# Altium schematic sheet FETs.SchDoc: FET System
size A4; ApprovedBy: Self; CheckedBy: Self; CompanyName: TAISAT; DrawnBy: Alperen FENERCİ; Organization: IKA; SheetNumber: 3; SheetTotal: 6
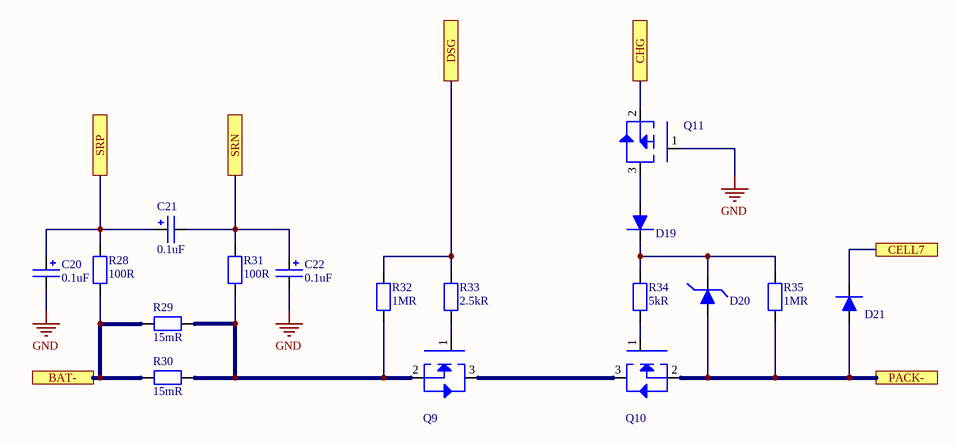
[diagram p0: FETs.SchDoc]

## Parts
C20  value 0.1uF  [CAP 0603]  (hidden comment: CAP 0603)
C21  value 0.1uF  [CAP 0603]  (hidden comment: CAP 0603)
C22  value 0.1uF  [CAP 0603]  (hidden comment: CAP 0603)
D19  1N4007W  [SOD123]  (value not drawn)
D20  MMSZ36V-HT  [SOD123]  (value not drawn)
D21  US1D_R1  [DO214AC]  (value not drawn)
Q9  IRF2804STRL  [D2PAK-7]  (value not drawn)
Q10  IRF2804STRL  [D2PAK-7]  (value not drawn)
Q11  PJA3441  [SOT23-3]  (value not drawn)
R28  value 100R  [RESISTOR 0603]  (hidden comment: RES 0603)
R29  value 15mR  [RESISTOR 2512]  (hidden comment: RES 2512)
R30  value 15mR  [RESISTOR 2512]  (hidden comment: RES 2512)
R31  value 100R  [RESISTOR 0603]  (hidden comment: RES 0603)
R32  value 1MR  [RESISTOR 0603]  (hidden comment: RES 0603)
R33  value 2.5kR  [RESISTOR 0603]  (hidden comment: RES 0603)
R34  value 5kR  [RESISTOR 0603]  (hidden comment: RES 0603)
R35  value 1MR  [RESISTOR 0603]  (hidden comment: RES 0603)

## Ports
BAT-, CELL7, CHG, DSG, PACK-, SRN, SRP

## Nets
GND: C20.2 C22.2 Q11.1(G)
BAT-: R28.1 R29.1 R30.1 ; port BAT-
CELL7: D21.1 ; port CELL7
CHG: Q11.2(S) ; port CHG
DSG: R32.2 R33.2 ; port DSG
PACK-: D20.2 D21.2 Q10.2(S) R35.1 ; port PACK-
SRN: C21.2 C22.1 R31.2 ; port SRN
SRP: C20.1 C21.1 R28.2 ; port SRP
NetD19_1: D19.1 D20.1 R34.2 R35.2
NetD19_2: D19.2 Q11.3(D)
NetQ9_1: Q9.1(G) R33.1
NetQ9_2: Q9.2(S) R29.2 R30.2 R31.1 R32.1
NetQ9_3: Q9.3(D) Q10.3(D)
NetQ10_1: Q10.1(G) R34.1

## Notes on the sheet
- Dosya Adı / File Name
- Proje Adı / Project Name
- Sayfa Adı / Sheet Name
- Şirket Adı / Company Name
- Tasarlayan / Designed By
- Takım / Team
- Kontrol Eden / Checked By
- Başlangıç Tarihi / Start Date
- Revize Tarihi / Revision Date
- Onaylayan / Approved By
- Sayfa / Sheet

## Library data of the parts
C20-C22 = CAP 0603: Multilayer Ceramic Capacitor; Capacitor Type: MLCC; Case/Package: 0603
D19 = 1N4007W: Diode Gen; Voltage: 1000V; Diode Type: General; Case/Package: DO-41-2
D20 = MMSZ36V-HT: Diode Zener; Voltage: 36V; Case/Package: SOD123; Diode Type: Zener
D21 = US1D_R1: Diode Gen; Voltage: 200V; Diode Type: General; Case/Package: DO-214AC
Q9 Q10 = IRF2804STRL: MOSFET; Voltage: 40V; Current: 160A; Transistor Type: N-CH; Case/Package: TO263-7
Q11 = PJA3441: MOSFET; Transistor Type: P-CH; Voltage: 40V; Current: 3.1A; Case/Package: SOT23
R28 R31-R35 = RES 0603: SMD Chip Resistor; Case/Package: 0603
R29 R30 = RES 2512: SMD Chip Resistor; Case/Package: 1206